# EAGLE schematic pcan-001 (EAGLE 9.6.2)
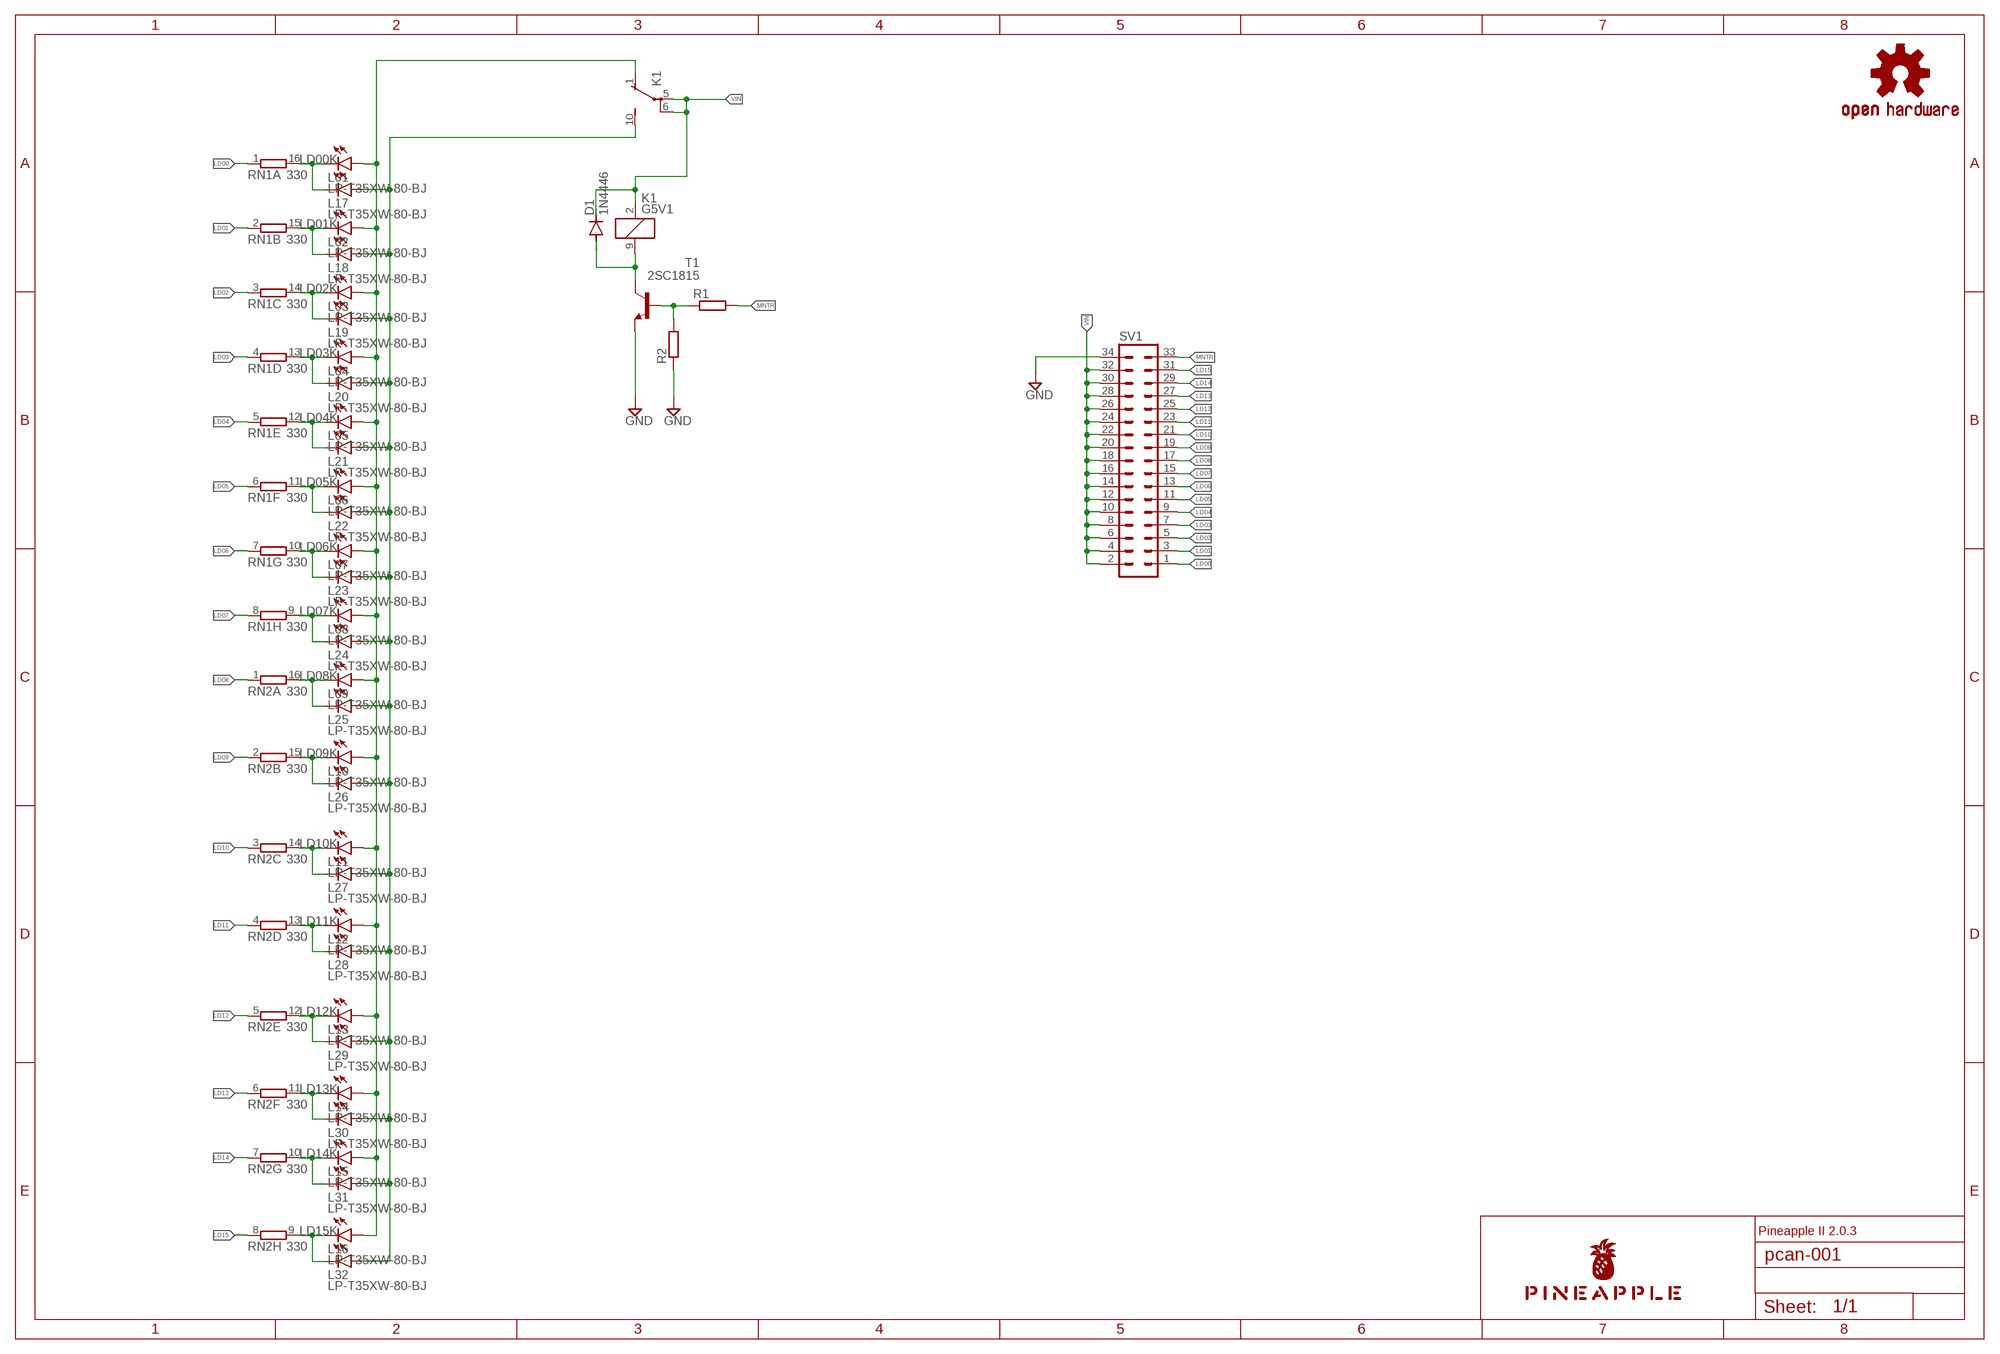
[diagram p0: schematic, sheet 1]

## Parts
D1  1N4446  [DO35-10]
K1  G5V1  [G5V1]
L01  LP-T35XW-80-BJ  LEDKA-3528ASYC  [KA-3528ASYC]
L02  LP-T35XW-80-BJ  LEDKA-3528ASYC  [KA-3528ASYC]
L03  LP-T35XW-80-BJ  LEDKA-3528ASYC  [KA-3528ASYC]
L04  LP-T35XW-80-BJ  LEDKA-3528ASYC  [KA-3528ASYC]
L05  LP-T35XW-80-BJ  LEDKA-3528ASYC  [KA-3528ASYC]
L06  LP-T35XW-80-BJ  LEDKA-3528ASYC  [KA-3528ASYC]
L07  LP-T35XW-80-BJ  LEDKA-3528ASYC  [KA-3528ASYC]
L08  LP-T35XW-80-BJ  LEDKA-3528ASYC  [KA-3528ASYC]
L09  LP-T35XW-80-BJ  LEDKA-3528ASYC  [KA-3528ASYC]
L10  LP-T35XW-80-BJ  LEDKA-3528ASYC  [KA-3528ASYC]
L11  LP-T35XW-80-BJ  LEDKA-3528ASYC  [KA-3528ASYC]
L12  LP-T35XW-80-BJ  LEDKA-3528ASYC  [KA-3528ASYC]
L13  LP-T35XW-80-BJ  LEDKA-3528ASYC  [KA-3528ASYC]
L14  LP-T35XW-80-BJ  LEDKA-3528ASYC  [KA-3528ASYC]
L15  LP-T35XW-80-BJ  LEDKA-3528ASYC  [KA-3528ASYC]
L16  LP-T35XW-80-BJ  LEDKA-3528ASYC  [KA-3528ASYC]
L17  LP-T35XW-80-BJ  LEDKA-3528ASYC  [KA-3528ASYC]
L18  LP-T35XW-80-BJ  LEDKA-3528ASYC  [KA-3528ASYC]
L19  LP-T35XW-80-BJ  LEDKA-3528ASYC  [KA-3528ASYC]
L20  LP-T35XW-80-BJ  LEDKA-3528ASYC  [KA-3528ASYC]
L21  LP-T35XW-80-BJ  LEDKA-3528ASYC  [KA-3528ASYC]
L22  LP-T35XW-80-BJ  LEDKA-3528ASYC  [KA-3528ASYC]
L23  LP-T35XW-80-BJ  LEDKA-3528ASYC  [KA-3528ASYC]
L24  LP-T35XW-80-BJ  LEDKA-3528ASYC  [KA-3528ASYC]
L25  LP-T35XW-80-BJ  LEDKA-3528ASYC  [KA-3528ASYC]
L26  LP-T35XW-80-BJ  LEDKA-3528ASYC  [KA-3528ASYC]
L27  LP-T35XW-80-BJ  LEDKA-3528ASYC  [KA-3528ASYC]
L28  LP-T35XW-80-BJ  LEDKA-3528ASYC  [KA-3528ASYC]
L29  LP-T35XW-80-BJ  LEDKA-3528ASYC  [KA-3528ASYC]
L30  LP-T35XW-80-BJ  LEDKA-3528ASYC  [KA-3528ASYC]
L31  LP-T35XW-80-BJ  LEDKA-3528ASYC  [KA-3528ASYC]
L32  LP-T35XW-80-BJ  LEDKA-3528ASYC  [KA-3528ASYC]
LOGO1  OSHW-LOGOS-COPPER  [OSHW-LOGO-S_COPPER]
R1  R-EU_0204/5  [0204/5]
R2  R-EU_0204/5  [0204/5]
RN1  330  8R-N  [DIL16]
RN2  330  8R-N  [DIL16]
SV1  ML34L  [ML34L]
T1  2SC1815  [TO92-ECB]
U$1  PINEAPPLE450_SILK  [PINEAPPLE450_SILK]

## Nets
GND [gnd]: R2.1 SV1.34 T1.E
LD00: RN1.1 SV1.1
LD00K: L01.C L17.C RN1.16
LD01: RN1.2 SV1.3
LD01K: L02.C L18.C RN1.15
LD02: RN1.3 SV1.5
LD02K: L03.C L19.C RN1.14
LD03: RN1.4 SV1.7
LD03K: L04.C L20.C RN1.13
LD04: RN1.5 SV1.9
LD04K: L05.C L21.C RN1.12
LD05: RN1.6 SV1.11
LD05K: L06.C L22.C RN1.11
LD06: RN1.7 SV1.13
LD06K: L07.C L23.C RN1.10
LD07: RN1.8 SV1.15
LD07K: L08.C L24.C RN1.9
LD08: RN2.1 SV1.17
LD08K: L09.C L25.C RN2.16
LD09: RN2.2 SV1.19
LD09K: L10.C L26.C RN2.15
LD10: RN2.3 SV1.21
LD10K: L11.C L27.C RN2.14
LD11: RN2.4 SV1.23
LD11K: L12.C L28.C RN2.13
LD12: RN2.5 SV1.25
LD12K: L13.C L29.C RN2.12
LD13: RN2.6 SV1.27
LD13K: L14.C L30.C RN2.11
LD14: RN2.7 SV1.29
LD14K: L15.C L31.C RN2.10
LD15: RN2.8 SV1.31
LD15K: L16.C L32.C RN2.9
MNTR: R1.2 SV1.33
N$17: D1.A K1.9 T1.C
N$19: R1.1 R2.2 T1.B
VIN [power]: D1.C K1.2 K1.5(2:P) K1.6(2:P) SV1.2 SV1.4 SV1.6 SV1.8 SV1.10 SV1.12 SV1.14 SV1.16 SV1.18 SV1.20 SV1.22 SV1.24 SV1.26 SV1.28 SV1.30 SV1.32
VINA [power]: K1.1(2:O) L01.A L02.A L03.A L04.A L05.A L06.A L07.A L08.A L09.A L10.A L11.A L12.A L13.A L14.A L15.A L16.A
VINB [power]: K1.10(2:S) L17.A L18.A L19.A L20.A L21.A L22.A L23.A L24.A L25.A L26.A L27.A L28.A L29.A L30.A L31.A L32.A

## Notes on the sheet
- Pineapple II 2.0.3

## Library data of the parts
D1 = diode:1N4446: DIODE high speed (Philips)
K1 = relay:G5V1: RELAY 1 x switch, 0.5 A/125 V AC, 1 A/24 V DC , Omron; MPN: G5V-1-DC24; OC_FARNELL: 9949593; OC_NEWARK: 36M6377
L01-L09 L10-L32 = led:LED: LED OSRAM: - CHIPLED LG R971, LG N971, LY N971, LG Q971, LY Q971, LO R971, LY R971 LH N974, LH R974 LS Q976, LO Q976, LY Q976 LO Q996 - Hyper CHIPLED LW Q18S LB Q993, LB Q99A, LB R99A - SideLED LS A670, LO A670, LY A670, LG A670, LP A670 LB A673, LV A673, LT A673, LW A673 LH A674 LY A675 LS A676, LA A676, LO A676, LY A676, LW A676 LS A679, LY A679, LG A679 - Hyper Micro SIDELED® LS Y876, LA Y876, LO Y876, LY Y876 LT Y87S - SmartLED LW L88C, LW L88S LB L89C, LB L89S, LG L890 LS L89K, LO L89K, LY L89K LS L896, LA L896, LO L896, LY L896 - TOPLED LS T670, LO T670, LY T670, LG T670, LP T670 LSG T670, LSP T670, LSY T670, LOP T670, LYG T670 LG T671, LOG T671, LSG T671 LB T673, LV T673, LT T673, LW T673 LH T674 LS T676, LA T676, LO T676, LY T676, LB T676, LH T676, LSB T676, LW T676 LB T67C, LV T67C, LT T67C, LS T67K, LO T67K, LY T67K, LW E67C LS E67B, LA E67B, LO E67B, LY E67B, LB E67C, LV E67C, LT E67C LW T67C LS T679, LY T679, LG T679 LS T770, LO T770, LY T770, LG T770, LP T770 LB T773, LV T773, LT T773, LW T773 LH T774 LS E675, LA E675, LY E675, LS T675 LS T776, LA T776, LO T776, LY T776, LB T776 LHGB T686 LT T68C, LB T68C - Hyper Mini TOPLED® LB M676 - Mini TOPLED Santana® LG M470 LS M47K, LO M47K, LY M47K Source: http://www.osram.convergy.de LUXEON: - LUMILED® LXK2-PW12-R00, LXK2-PW12-S00, LXK2-PW14-U00, LXK2-PW14-V00 LXK2-PM12-R00, LXK2-PM12-S00, LXK2-PM14-U00 LXK2-PE12-Q00, LXK2-PE12-R00, LXK2-PE12-S00, LXK2-PE14-T00, LXK2-PE14-U00 LXK2-PB12-K00, LXK2-PB12-L00, LXK2-PB12-M00, LXK2-PB14-N00, LXK2-PB14-P00, LXK2-PB14-Q00 LXK2-PR12-L00, LXK2-PR12-M00, LXK2-PR14-Q00, LXK2-PR14-R00 LXK2-PD12-Q00, LXK2-PD12-R00, LXK2-PD12-S00 LXK2-PH12-R00, LXK2-PH12-S00 LXK2-PL12-P00, LXK2-PL12-Q00, LXK2-PL12-R00 Source: www.luxeon.com KINGBRIGHT: KA-3528ASYC Source: www.kingbright.com
LOGO1 = SparkFun-Aesthetics:OSHW-LOGO: Open-Source Hardware (OSHW) Logo This logo indicates the piece of hardware it is found on incorporates a OSHW license and/or adheres to the definition of open source hardware found here: http://freedomdefined.org/OSHW
R1 R2 = rcl:R-EU_: RESISTOR, European symbol; SPICEPREFIX: R
RN1 RN2 = resistor-dil:8R-N: DIL RESISTOR; OC_FARNELL: unknown; OC_NEWARK: unknown
SV1 = con-ml:ML34L: HARTING; OC_FARNELL: unknown; OC_NEWARK: unknown
T1 = transistor:2SC1815: NPN EPITAXIAL TRANSISTOR Source: TOSHIBA .. 2SC1815 1.pdf
U$1 = pineapple:PINEAPPLE450_SILK

## Net classes
0 default: width 0.152 mm, drill 0.152 mm, clearance 0.152 mm
1 gnd: width 1.016 mm, drill 0.152 mm, clearance 0.152 mm
2 power: width 0.61 mm, drill 0.152 mm, clearance 0.152 mm
3 analog: width 0.305 mm, drill 0.152 mm, clearance 0.152 mm
4 superpower: width 1.016 mm, drill 0.152 mm, clearance 0.152 mm